# Altium project ece315.PrjPcb
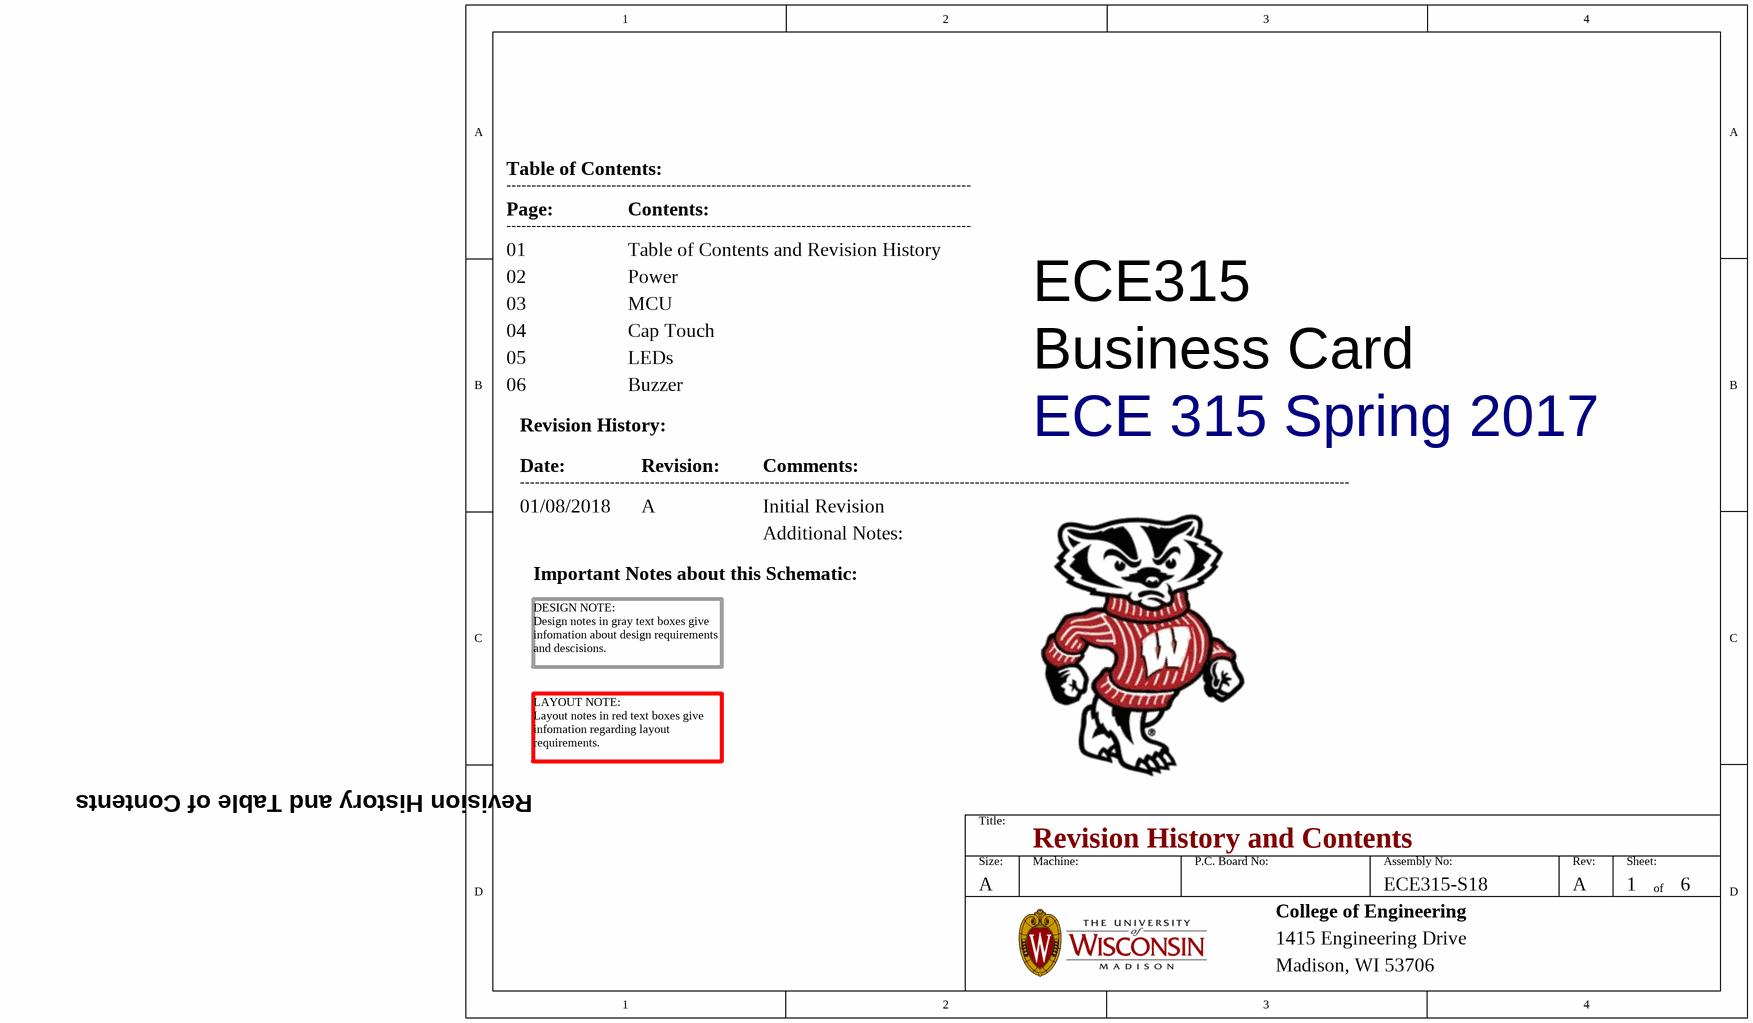
[diagram p0: 01-Revision_History_and_Contents.SchDoc]
AssemblyNumber: ECE315-S18
5 sheets, 40 parts. Net scope: global (net labels, ports and power ports of the same name join across sheets).
Board file: business_card.PcbDoc
Sheets:
  01-Revision_History_and_Contents.SchDoc
  02-Power.SchDoc
  03_MCU.SchDoc
  04_CapTouch.SchDoc
  05_LEDs.SchDoc

## Sheet 01-Revision_History_and_Contents.SchDoc: Revision History and Contents
size A; Date: 01/08/2018; ApprovedBy: JSK; CheckedBy: JSK; Author: JSK; CompanyName: University of Wisconsin; DrawnBy: JSK; Engineer: JSK; Organization: ECE 315; Address1: College of Engineering; Address2: 1415 Engineering Drive; Address3: Madison, WI 53706; Address4: ECE 315 Spring 2017; Revision: A; SheetNumber: 1; SheetTotal: 6

### Notes on the sheet
- Table of Contents:
- Page:
- ---------------------------------------------------------------------------------------------
- Contents:
- 01
- 02
- Table of Contents and Revision History
- Power
- 03
- 04
- 05
- MCU
- Cap Touch
- LEDs
- ECE315
- 06
- Revision History:
- Buzzer
- Business Card
- Date:
- ----------------------------------------------------------------------------------------------------------------------------------------------------------------------
- Revision:
- Comments:
- 01/08/2018
- A
- Initial Revision
- Additional Notes:
- Important Notes about this Schematic:
- DESIGN NOTE:
  Design notes in gray text boxes give infomation about design requirements and descisions.
- LAYOUT NOTE:
  Layout notes in red text boxes give infomation regarding layout requirements.
- Revision History and Table of Contents
- Title:
- Size:
- Machine:
- P.C. Board No:
- Assembly No:
- Rev:
- Sheet:
- of
- College of Engineering
- 1415 Engineering Drive
- Madison, WI 53706

## Sheet 02-Power.SchDoc: ECE315 Power and Programming
size A; Date: 01/08/2018; ApprovedBy: JSK; CheckedBy: JSK; Author: JSK; CompanyName: University of Wisconsin; DrawnBy: JSK; Engineer: JSK; Organization: ECE 315; Address1: College of Engineering; Address2: 1415 Engineering Drive; Address3: Madison, WI 53706; Address4: ECE 315 Spring 2018; Revision: A; SheetNumber: 2; SheetTotal: 6; AssemblyNumber: ECE315-S18; ApprovedDate: 4/25/2017
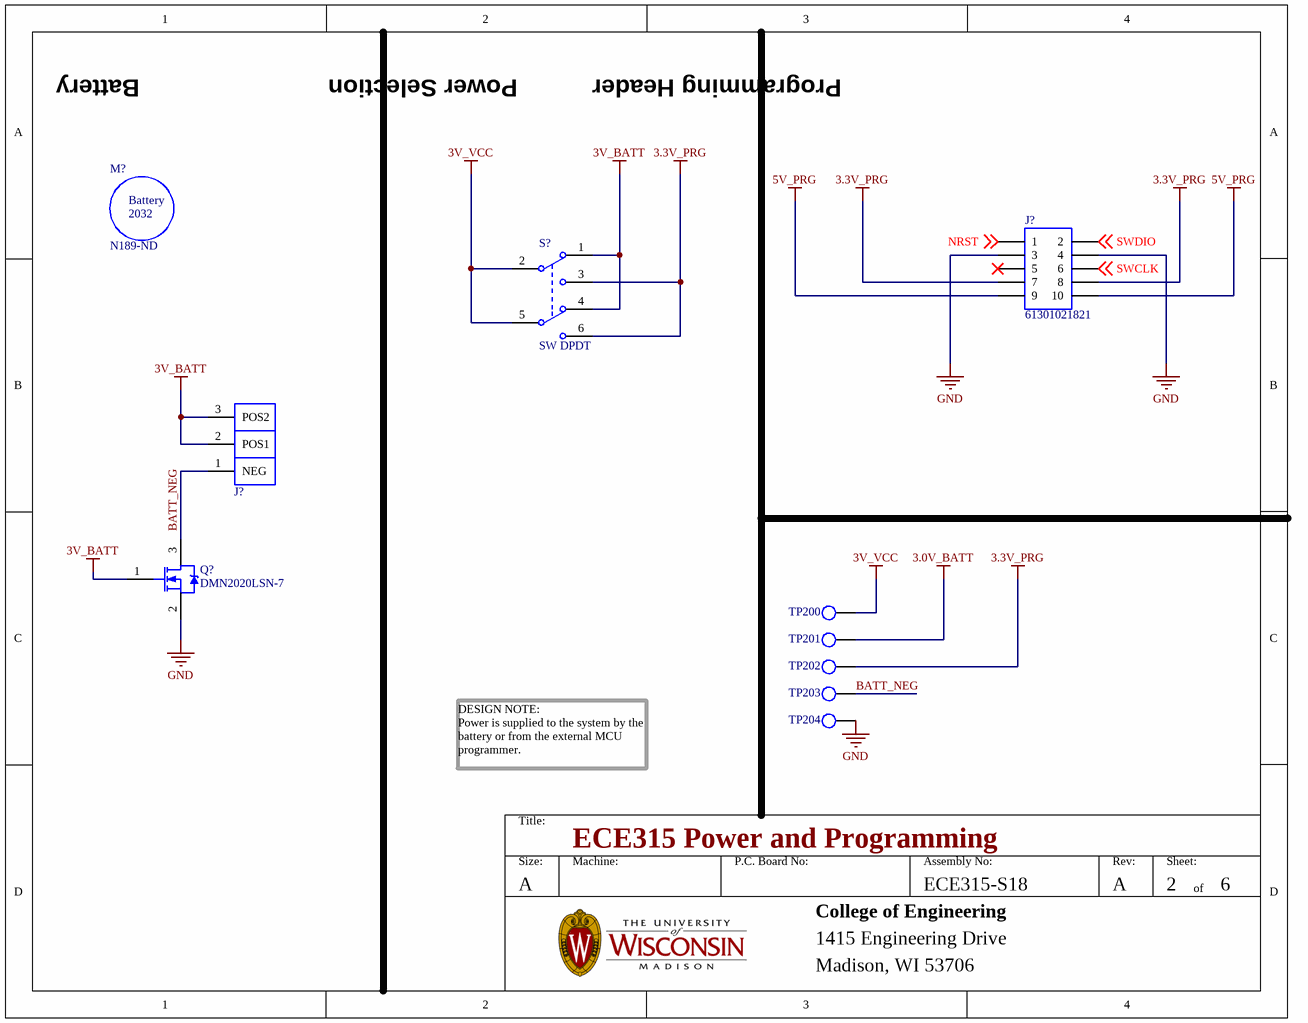
[diagram p1: 02-Power.SchDoc]

### Parts
(Parts that share a designator on the sheet are numbered #1, #2 ... from top to bottom, then left to right.)
J?#1  Manufacturer Part Number: 61301021821  [CONN_ST_PROGRAMMER]  (hidden comment: CONN_ST_PROGRAMMER)
J?#2  CONN_BAT_2032  [BATT_2032]  (value not drawn)
M?  Supplier Part Number 1: N189-ND  (hidden comment: BATTERY_2032)
Q?  Manufacturer Part Number: DMN2020LSN-7  [SOT23]  (hidden comment: IC_NMOS_DMN2020LSN)
S?  SW DPDT  [DPDT]
TP200  TP_1206  [TP-SMC-1206]  (value not drawn)
TP201  TP_1206  [TP-SMC-1206]  (value not drawn)
TP202  TP_1206  [TP-SMC-1206]  (value not drawn)
TP203  TP_1206  [TP-SMC-1206]  (value not drawn)
TP204  TP_1206  [TP-SMC-1206]  (value not drawn)

### Nets
3.0V_BATT: TP201.1
3.3V_PRG: J?#1.7 J?#1.8 S?.3(NO1) S?.6(NO2) TP202.1
3V_BATT: J?#2.2(POS1) J?#2.3(POS2) Q?.1 S?.1(NC1) S?.4(NC2)
3V_VCC: S?.2(COMMON1) S?.5(COMMON2) TP200.1
5V_PRG: J?#1.9 J?#1.10
GND: J?#1.3 J?#1.4 Q?.2 TP204.1
BATT_NEG: J?#2.1(NEG) Q?.3 TP203.1
NRST: J?#1.1 ; off-sheet NRST
SWCLK: J?#1.6 ; off-sheet SWCLK
SWDIO: J?#1.2 ; off-sheet SWDIO

Not connected (* = marked no-connect by the designer): J?#1 5*

### Notes on the sheet
- Battery
- Power Selection
- Programming Header
- DESIGN NOTE:
  Power is supplied to the system by the battery or from the external MCU programmer.
- Title:
- Size:
- A
- Machine:
- P.C. Board No:
- Assembly No:
- Rev:
- Sheet:
- of
- College of Engineering
- 1415 Engineering Drive
- Madison, WI 53706
- (in symbol BATTERY_2032) Battery; 2032

### Library data of the parts
J?#1 = CONN_ST_PROGRAMMER: CONN HEADER 2.54MM 10POS GOLD; Manufacturer: Wurth Electronics Inc.; Style: Board to Board; Number of Positions: 10; Number of Positions Loaded: All; Pitch - Mating: 0.100" (2.54mm); Contact Length - Post: 0.122" (3.10mm); Material Flammability Rating: UL94 V-0; Current Rating: 3A; Voltage Rating: 250VAC; Supplier 1: Digi-Key; RoHS: RoHS Compliant; Category: Connectors, Interconnects; Stock 1: 4086; Pricing 1: 1=0.74, 10=0.728, 50=0.672, 100=0.616, 320=0.56 (USD); Packaging: Tray; Part Status: Active; Connector Type: Header; Contact Type: Forked; Row Spacing - Mating: 0.100" (2.54mm); Mounting Type: Through Hole; Termination: Solder; Fastening Type: Push-Pull; Contact Finish - Mating: Gold; Contact Finish Thickness - Mating: -; Insulation Color: Black; Insulation Height: 0.331" (8.40mm); Operating Temperature: -40°C ~ 105°C; Contact Finish - Post: Gold; Mated Stacking Heights: -; Ingress Protection: -; Features: -; Applications: -; Insulation Material: Polybutylene Terephthalate (PBT); Contact Shape: Square; Contact Material: Copper Alloy; Contact Finish Thickness - Post: -; ComponentLink1URL: http://katalog.we-online.de/em/datasheet/6130xx21821.pdf; ComponentLink1Description: http://katalog.we-online.de/em/datasheet/6130xx21821.pdf; Supplier Part Number 1: 732-2861-ND
J?#2 = CONN_BAT_2032: HOLDER BATTERY 20MM COIN; Manufacturer: Linx; Manufacturer Part Number: BAT-HLD-001; Brand: Linx Technologies; Number of Batteries: 1 Battery; Number of Contacts: 1 Contact; Supplier 1: Digikey; Stock 1: 950; Pricing 1: 1=0.28, 25=0.2572, 100=0.233, 1000=0.2196 (USD); Product Category: Coin Cell Battery Holders; RoHS: Details; Product: Battery Holders; Battery Cell Size: 20 mm; Termination Style: SMD/SMT; Packaging: Bulk; Factory Pack Quantity: 1000; Type: 20 mm Battery Holder; ComponentLink1URL: https://datasheet.ciiva.com/4/bat-hld-001-4035.pdf; ComponentLink1Description: https://datasheet.ciiva.com/4/bat-hld-001-4035.pdf; ComponentLink2URL: https://datasheet.ciiva.com/4642/bat-hld-001-220194-4642567.pdf; ComponentLink2Description: https://datasheet.ciiva.com/4642/bat-hld-001-220194-4642567.pdf; ComponentLink3URL: https://datasheet.ciiva.com/16207/bat-hld-001-16207212.pdf; ComponentLink3Description: https://datasheet.ciiva.com/16207/bat-hld-001-16207212.pdf; Supplier Part Number 1: BAT-HLD-001-ND
M? = BATTERY_2032: Manufacturer: Energizer; Manufacturer Part Number: CR2032VP; MSDS Material Safety Datasheet: Lithium Manganese Dioxide(Coin/Button) PSDS; Battery Chemistry: Lithium; Battery Cell Size: Coin, 20.0mm; Voltage - Rated: 3V; Capacity: 240mAh; Discharge Rate: 190µA; Shipping Info: Due to possible restrictions, a change in ship method may be required.; Dynamic Catalog: CR (Coin) Series; For Use With: N533-ND / - CAP LIGHT 3-LED LITHIUM COIN; Associated Product: 952-1737-6-ND / - HOLDER BATT COIN CR2032/20MM / 952-1737-1-ND / - HOLDER BATT COIN CR2032/20MM / 952-1735-6-ND / - HOLDER BATT COIN CR2032/20MM / 952-1735-1-ND / - HOLDER BATT COIN CR2032/20MM / 952-1737-2-ND / - HOLDER BATT COIN CR2032/20MM / 952-1743-ND / - HOLDER BATT COIN CR2032/20MM / 952-1735-2-ND / - HOLDER BATT COIN CR2032/20MM / BH-20H-1TCT-ND / - HOLDER BATT COIN CELL 2032 SMD / 3082TRK-ND / - RETAINER COIN CELL 20MM SMD / 3072TRK-ND / - RETAINER COIN CELL 20MM SMD / More...; Other Names: 547-189 / 547-189-ND / N189; Supplier 1: Digikey; Stock 1: 563743; Pricing 1: 1=0.34, 10=0.31, 50=0.2758, 100=0.2414, 250=0.2207, 500=0.2069, 1000=0.1841, 2500=0.1729 (USD); Standard Package: 200; Category: Battery Products; Family: Batteries Non-Rechargeable (Primary); Series: CR2032; Size / Dimension: 0.79" Dia x 0.13" H (20.0mm x 3.2mm); Termination Style: Requires Holder; Weight: 0.1 oz (2.85g); ComponentLink1URL: https://datasheet.ciiva.com/6572/cr2032-6572607.pdf; ComponentLink1Description: https://datasheet.ciiva.com/6572/cr2032-6572607.pdf
Q? = IC_NMOS_DMN2020LSN: Manufacturer: Diodes; Rise Time: 12.49ns; Continuous Drain Current (ID): 6.9A; Gate to Source Voltage (Vgs): 12V; Turn-Off Delay Time: 35.89ns; Turn-On Delay Time: 11.67ns; Fall Time: 12.33ns; Input Capacitance: 1.149nF; Number of Elements: 1; Max Power Dissipation: 610mW; Rds On Max: 20mR; Drain to Source Resistance: 13mR; Drain to Source Voltage (Vdss): 20V; Threshold Voltage: 1V; Element Configuration: Single; Supplier 1: Digikey; Stock 1: 13099; Pricing 1: 1=0.52, 10=0.418, 100=0.2843, 500=0.2132, 1000=0.1599 (USD); Mount: Surface Mount; Case/Package: SC; Number of Pins: 3; Weight: 0.000282oz; Min Operating Temperature: -55°C; Max Operating Temperature: 150°C; Packaging: Tape and Reel; Package Quantity: 3000; Power Dissipation: 610mW; Number of Channels: 1; Length: 3.1mm; Height: 1.3mm; Width: 1.7mm; REACH SVHC: No SVHC; Lead Free: Lead Free; ComponentLink1URL: https://datasheet.ciiva.com/934/ds31946-934870.pdf; ComponentLink1Description: https://datasheet.ciiva.com/934/ds31946-934870.pdf; ComponentLink2URL: https://datasheet.ciiva.com/25625/0900766b8104e58b-25625153.pdf; ComponentLink2Description: https://datasheet.ciiva.com/25625/0900766b8104e58b-25625153.pdf; ComponentLink3URL: https://datasheet.ciiva.com/4444/ds31946-65244-4444482.pdf; ComponentLink3Description: https://datasheet.ciiva.com/4444/ds31946-65244-4444482.pdf; ComponentLink4URL: https://datasheet.ciiva.com/934/ds31946-934871.pdf; ComponentLink4Description: https://datasheet.ciiva.com/934/ds31946-934871.pdf; ComponentLink5URL: https://datasheet.ciiva.com/934/ds31946-934872.pdf; ComponentLink5Description: https://datasheet.ciiva.com/934/ds31946-934872.pdf; Supplier Part Number 1: DMN2020LSN-7DICT-ND
S? = SW DPDT: Switch; Manufacturer: ITT /  C&K Components; Manufacturer Part Number: JS202011SCQN; Actuator Color: Black; Maximum DC Voltage Rating: 6 V; Actuator Material: Nylon 4/6; Electrical Life: 15000 Cycles; Body Orientation: Straight; Maximum Contact Resistance: 70 mOhm; Actuator Style: Top Slide; Dielectric Strength: 500 VAC; Minimum Insulation Resistance: 100 MOhm; Contact Rating @ Voltage: 0.3@6VDC A; COO: US; Published: 24-Mar-1999; LatestRevisionDate: 29-May-2009; LatestRevisionNote: IPC-7351 Footprint Added.; PackageVersion: Mar-2001; PackageReference: SOT23-6; Publisher: Altium Limited; PackageDescription: 6-Pin SOT-23 Package 0.95 mm Pitch, 2.7 mm Lead Span; Code_JEITA: SC-74; Code_IPC: SOT26A-6; Supplier 1: C&K Components; Stock 1: 22661; Pricing 1: 1=0.46, 10=0.441, 25=0.4316, 50=0.3858, 100=0.3674, 250=0.3582, 500=0.3031 (USD); Part No: JS202011SCQN; RoHS: Yes; Supplier Standard Pack: 5,000; Type: Sub-Miniature; Maximum AC Voltage Rating: N/A; Family: JS; Contact Material: Copper Alloy; Seal Description: N/A; Pole Throw Configuration: DPDT; Mechanical Life: N/A; Packaging: Tape and Reel; Contact Plating: Silver; Switch Configuration: N/A; Housing Material: Nylon 4/6; Product Weight: N/A; Base Material: N/A; Mounting: Surface Mount,Gull Wing; Seal Location: N/A; Operating Temperature: -40 to 85 C; Dimension: 9 x 7.5 x 5.5 mm; HTS: 8536509050; ECCN: EAR99; ComponentLink1URL: https://datasheet.ciiva.com/23829/1707718-23829488.pdf; ComponentLink1Description: https://datasheet.ciiva.com/23829/1707718-23829488.pdf; ComponentLink2URL: https://datasheet.ciiva.com/2889/js-29aug13-2889127.pdf; ComponentLink2Description: https://datasheet.ciiva.com/2889/js-29aug13-2889127.pdf; ComponentLink3URL: https://datasheet.ciiva.com/2889/js-15sept15-2889128.pdf; ComponentLink3Description: https://datasheet.ciiva.com/2889/js-15sept15-2889128.pdf; ComponentLink4URL: https://datasheet.ciiva.com/2889/js-15sept15-2889129.pdf; ComponentLink4Description: https://datasheet.ciiva.com/2889/js-15sept15-2889129.pdf; ComponentLink5URL: https://datasheet.ciiva.com/22630/1707718-22630697.pdf; ComponentLink5Description: https://datasheet.ciiva.com/22630/1707718-22630697.pdf; ComponentLink6URL: https://datasheet.ciiva.com/8625/js-9dec14-8625470.pdf; ComponentLink6Description: https://datasheet.ciiva.com/8625/js-9dec14-8625470.pdf; Supplier Part Number 1: 401-2002-1-ND
TP200-TP204 = TP_1206: Test Point SMD 1206; Manufacturer: TE Connectivity (Tyco Electronics); Manufacturer Part Number: 1625854-1; Resistance Value: 0 Ohm; Temperature Coefficient: N/R; Supplier 1: Digi-Key; Supplier Part Number 1: A106143CT-ND; Stock 1: 31937; Pricing 1: 1=0.28, 10=0.261, 25=0.224, 50=0.1902, 100=0.1828, 250=0.1641, 500=0.1567, 1000=0.1306 (USD); Case Size: 1206; Dimension: 3.2 x 1.6 x 1.25mm; Family: RC; Mounting: Surface Mount; Operating Temperature: -55 to 125 C; Part No: 1625854-1; RoHS: Yes; Packaging: Tape and Reel; Termination Style: N/R; Terminal Pitch: N/R; Power Rating: N/R; Tolerance: N/R; ComponentLink1URL: https://datasheet.ciiva.com/6439/eng-ds-1773266-a-6439169.pdf; ComponentLink1Description: https://datasheet.ciiva.com/6439/eng-ds-1773266-a-6439169.pdf; ComponentLink2URL: https://datasheet.ciiva.com/30136/1773266-a-30136341.pdf; ComponentLink2Description: https://datasheet.ciiva.com/30136/1773266-a-30136341.pdf; ComponentLink3URL: https://datasheet.ciiva.com/6439/eng-ds-1773266-a-6439080.pdf; ComponentLink3Description: https://datasheet.ciiva.com/6439/eng-ds-1773266-a-6439080.pdf; ComponentLink4URL: https://datasheet.ciiva.com/6439/eng-ds-1773266-a-6439081.pdf; ComponentLink4Description: https://datasheet.ciiva.com/6439/eng-ds-1773266-a-6439081.pdf; ComponentLink5URL: https://datasheet.ciiva.com/6439/eng-ds-1773266-a-6439083.pdf; ComponentLink5Description: https://datasheet.ciiva.com/6439/eng-ds-1773266-a-6439083.pdf

## Sheet 03_MCU.SchDoc: ECE315 MCU
size A; Date: 4/25/2017; ApprovedBy: JSK; CheckedBy: JSK; Author: JSK; CompanyName: University of Wisconsin; DrawnBy: JSK; Engineer: JSK; Organization: ECE 315; Address1: College of Engineering; Address2: 1415 Engineering Drive; Address3: Madison, WI 53706; Address4: ECE 315 Spring 2018; Revision: A; SheetNumber: 3; SheetTotal: 6; AssemblyNumber: ECE315-S18; ApprovedDate: 01/08/2018
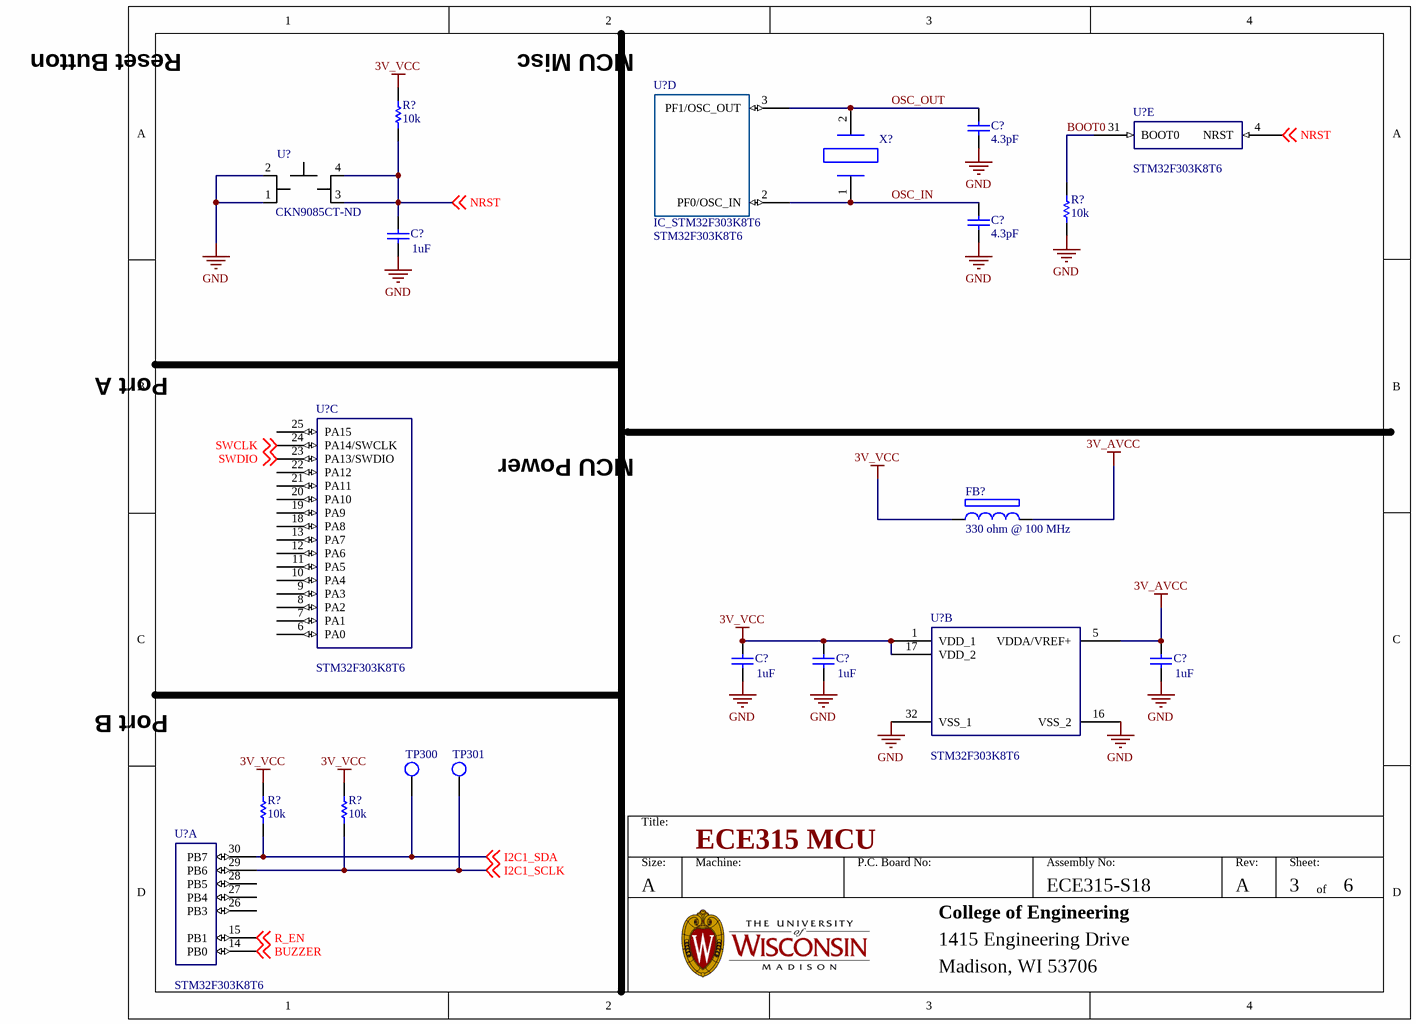
[diagram p2: 03_MCU.SchDoc]

### Parts
(Parts that share a designator on the sheet are numbered #1, #2 ... from top to bottom, then left to right.)
C?#1  Manufacturer Part Number: 4.3pF  [CAP_0805]  (hidden comment: CAP_0805_P_004.30)
C?#2  Capacity: 1uF  [CAP_0805]  (hidden comment: CAP_0805_U_001.00)
C?#3  Manufacturer Part Number: 4.3pF  [CAP_0805]  (hidden comment: CAP_0805_P_004.30)
C?#4  Capacity: 1uF  [CAP_0805]  (hidden comment: CAP_0805_U_001.00)
C?#5  Capacity: 1uF  [CAP_0805]  (hidden comment: CAP_0805_U_001.00)
C?#6  Capacity: 1uF  [CAP_0805]  (hidden comment: CAP_0805_U_001.00)
FB?  330 ohm @ 100 MHz  [FB_0805]
R?#1  10K  [RES_0805]
R?#2  10K  [RES_0805]
R?#3  10K  [RES_0805]
R?#4  10K  [RES_0805]
TP300  TP_1206  [TP-SMC-1206]  (value not drawn)
TP301  TP_1206  [TP-SMC-1206]  (value not drawn)
U?#1  IC_STM32F303K8T6  Manufacturer Part Number: STM32F303K8T6  [IC_STM32M]  (part D of 5)
U?#2  Manufacturer Part Number: STM32F303K8T6  [IC_STM32M]  (hidden comment: IC_STM32F303K8T6)  (part E of 5)
U?#3  Supplier Part Number 1: CKN9085CT-ND  [SW_6mm_6mm_SMT]  (hidden comment: SW_6mm_6mm_SMT)
U?#4  Manufacturer Part Number: STM32F303K8T6  [IC_STM32M]  (hidden comment: IC_STM32F303K8T6)  (part B of 5)
U?#5  Manufacturer Part Number: STM32F303K8T6  [IC_STM32M]  (hidden comment: IC_STM32F303K8T6)  (part C of 5)
U?#6  Manufacturer Part Number: STM32F303K8T6  [IC_STM32M]  (hidden comment: IC_STM32F303K8T6)  (part A of 5)
X?  32.7680KHZ 12.5PF  [NX3215SA-32.768K-STD-MUA-8]  (value not drawn)

### Nets
3V_AVCC: C?#6.1 FB?.2 U?#4.5(VDDA/VREF+)
3V_VCC: C?#4.1 C?#5.1 FB?.1 R?#1.2 R?#3.2 R?#4.2 U?#4.1(VDD_1) U?#4.17(VDD_2)
GND: C?#1.1 C?#2.2 C?#3.1 C?#4.2 C?#5.2 C?#6.2 R?#2.1 U?#3.1 U?#3.2 U?#4.16(VSS_2) U?#4.32(VSS_1)
BOOT0: R?#2.2 U?#2.31(BOOT0)
BUZZER: U?#6.14(PB0) ; off-sheet BUZZER
I2C1_SCLK: R?#4.1 TP301.1 U?#6.29(PB6) ; off-sheet I2C1_SCLK
I2C1_SDA: R?#3.1 TP300.1 U?#6.30(PB7) ; off-sheet I2C1_SDA
NRST: C?#2.1 R?#1.1 U?#2.4(NRST) U?#3.3 U?#3.4(VCCIO) ; off-sheet NRST
OSC_IN: C?#3.2 U?#1.2(PF0/OSC_IN) X?.1
OSC_OUT: C?#1.2 U?#1.3(PF1/OSC_OUT) X?.2
R_EN: U?#6.15(PB1) ; off-sheet R_EN
SWCLK: U?#5.24(PA14/SWCLK) ; off-sheet SWCLK
SWDIO: U?#5.23(PA13/SWDIO) ; off-sheet SWDIO

Not connected (* = marked no-connect by the designer): U?#5 6(PA0) 7(PA1) 8(PA2) 9(PA3) 10(PA4) 11(PA5) 12(PA6) 13(PA7) 18(PA8) 19(PA9) 20(PA10) 21(PA11) 22(PA12) 25(PA15); U?#6 26(PB3) 27(PB4) 28(PB5)

### Notes on the sheet
- Reset Button
- (near U?#1) MCU Misc
- Port A
- MCU Power
- Port B
- Title:
- Size:
- A
- Machine:
- P.C. Board No:
- Assembly No:
- Rev:
- Sheet:
- of
- College of Engineering
- 1415 Engineering Drive
- Madison, WI 53706

### Library data of the parts
C?#1 C?#3 = CAP_0805_P_004.30: CAP CER 4.3PF 100V NP0 0805; Manufacturer: AVX Corporation; Tolerance: ±0.25pF; Temperature Coefficient: C0G, NP0; Notification: Current market demand for these product types have resulted in fluctuating and extending lead times. Lead times may differ.; Supplier 1: Digi-Key; RoHS: RoHS Compliant; Category: Capacitors; Stock 1: 21910; Pricing 1: 1=0.24, 10=0.167, 100=0.0946, 500=0.0668, 1000=0.05844 (USD); Packaging: Cut Tape (CT); Part Status: Active; Voltage - Rated: 100V; Operating Temperature: -55°C ~ 125°C; Features: -; Ratings: -; Applications: General Purpose; Failure Rate: -; Mounting Type: Surface Mount, MLCC; Package / Case: 0805 (2012 Metric); Size / Dimension: 0.079" L x 0.049" W (2.01mm x 1.25mm); Height - Seated (Max): -; Thickness (Max): 0.037" (0.94mm); Lead Spacing: -; Lead Style: -; ComponentLink1URL: http://datasheets.avx.com/C0GNP0-Dielectric.pdf; ComponentLink1Description: http://datasheets.avx.com/C0GNP0-Dielectric.pdf; Supplier Part Number 1: 478-10404-1-ND
C?#2 C?#4-C?#6 = CAP_0805_U_001.00: CAP CER 1UF 16V 10% X7R 0805; Manufacturer: Yageo; Manufacturer Part Number: CC0805KKX7R7BB105; Notification: Current market demand for these product types have resulted in fluctuating and extending lead times. Lead times may differ.; Supplier 1: Digi-Key; RoHS: RoHS Compliant; Category: Capacitors; Stock 1: 1057802; Pricing 1: 1=0.11, 10=0.079, 100=0.0352, 500=0.02516, 1000=0.01977 (USD); Packaging: Cut Tape (CT); Part Status: Active; Tolerance: ±10%; Voltage - Rated: 16V; Temperature Coefficient: X7R; Operating Temperature: -55°C ~ 125°C; Features: -; Ratings: -; Applications: General Purpose; Failure Rate: -; Mounting Type: Surface Mount, MLCC; Package / Case: 0805 (2012 Metric); Size / Dimension: 0.079" L x 0.049" W (2.00mm x 1.25mm); Height - Seated (Max): -; Thickness (Max): 0.049" (1.25mm); Lead Spacing: -; Lead Style: -; ComponentLink1URL: http://www.yageo.com/documents/recent/UPY-GPHC_X7R_6.3V-to-50V_18.pdf; ComponentLink1Description: http://www.yageo.com/documents/recent/UPY-GPHC_X7R_6.3V-to-50V_18.pdf; Supplier Part Number 1: 311-1365-1-ND
FB? = FB 330 ohm @ 100 MHz: Manufacturer: TDK Corporation; Manufacturer Part Number: MPZ2012S331AT000; Current Rating: 2.5A; DC Resistance (DCR): 50 mOhm Max; Filter Type: Differential Mode - Single; Supplier 1: Digi-Key; RoHS: RoHS Compliant; Category: Filters; Stock 1: 154063; Pricing 1: 1=0.12, 10=0.101, 100=0.0574, 250=0.04528, 500=0.03824, 1000=0.03221 (USD); Packaging: Cut Tape (CT); Impedance @ Frequency: 330 Ohm @ 100MHz; Package / Case: 0805 (2012 Metric); Mounting Type: Surface Mount; Height (Max): 0.041" (1.05mm); Size / Dimension: 0.079" L x 0.049" W (2.00mm x 1.25mm); ComponentLink1URL: http://product.tdk.com/en/catalog/datasheets/beads_commercial_power_mpz_en.pdf; ComponentLink1Description: http://product.tdk.com/en/catalog/datasheets/beads_commercial_power_mpz_en.pdf; Supplier Part Number 1: 445-1569-1-ND
R?#1-R?#4 = RES_0805_K_010.00: RES SMD 10K OHM 1% 1/8W 0805; Manufacturer: Yageo; Manufacturer Part Number: RT0805FRE0710KL; Power (Watts): 0.125W, 1/8W; Temperature Coefficient: ±50ppm/°C; Supplier 1: Digi-Key; RoHS: RoHS Compliant; Category: Resistors; Stock 1: 74175; Pricing 1: 1=0.1, 10=0.075, 100=0.0287, 1000=0.01261, 2500=0.01089 (USD); Packaging: Cut Tape (CT); Part Status: Active; Tolerance: ±1%; Composition: Thin Film; Features: Moisture Resistant; Operating Temperature: -55°C ~ 155°C; Package / Case: 0805 (2012 Metric); Supplier Device Package: 0805; Size / Dimension: 0.079" L x 0.049" W (2.00mm x 1.25mm); Height - Seated (Max): 0.024" (0.60mm); Failure Rate: -; ComponentLink1URL: http://www.yageo.com/documents/recent/PYu-RT_1-to-0.01_RoHS_L_9.pdf; ComponentLink1Description: http://www.yageo.com/documents/recent/PYu-RT_1-to-0.01_RoHS_L_9.pdf; Supplier Part Number 1: YAG1239CT-ND; Resistance: 10k
TP300 TP301 = TP_1206: as TP200 on sheet 02-Power; Supplier 1: Digi-Key; Stock 1: 31937; Pricing 1: 1=0.28, 10=0.261, 25=0.224, 50=0.1902, 100=0.1828, 250=0.1641, 500=0.1567, 1000=0.1306 (USD); Case Size: 1206; Dimension: 3.2 x 1.6 x 1.25mm; Family: RC; Mounting: Surface Mount; Operating Temperature: -55 to 125 C; Part No: 1625854-1; RoHS: Yes; Packaging: Tape and Reel; Termination Style: N/R; Terminal Pitch: N/R; Power Rating: N/R; Tolerance: N/R; ComponentLink1URL: https://datasheet.ciiva.com/6439/eng-ds-1773266-a-6439169.pdf; ComponentLink1Description: https://datasheet.ciiva.com/6439/eng-ds-1773266-a-6439169.pdf; ComponentLink2URL: https://datasheet.ciiva.com/30136/1773266-a-30136341.pdf; ComponentLink2Description: https://datasheet.ciiva.com/30136/1773266-a-30136341.pdf; ComponentLink3URL: https://datasheet.ciiva.com/6439/eng-ds-1773266-a-6439080.pdf; ComponentLink3Description: https://datasheet.ciiva.com/6439/eng-ds-1773266-a-6439080.pdf; ComponentLink4URL: https://datasheet.ciiva.com/6439/eng-ds-1773266-a-6439081.pdf; ComponentLink4Description: https://datasheet.ciiva.com/6439/eng-ds-1773266-a-6439081.pdf; ComponentLink5URL: https://datasheet.ciiva.com/6439/eng-ds-1773266-a-6439083.pdf; ComponentLink5Description: https://datasheet.ciiva.com/6439/eng-ds-1773266-a-6439083.pdf; Supplier Part Number 1: A106143CT-ND
U?#1 U?#2 U?#4-U?#6 = IC_STM32F303K8T6: Manufacturer: STMicroelectronics; Core Processor: ARM® Cortex®-M4; Core Size: 32-Bit; Speed: 72MHz; Connectivity: CAN, I²C, IrDA, LIN, SPI, UART/USART; Peripherals: DMA, I²S, POR, PWM, WDT; Program Memory Size: 64KB (64K x 8); Program Memory Type: FLASH; RAM Size: 12K x 8; Voltage - Supply (Vcc/Vdd): 2 V ~ 3.6 V; Data Converters: A/D 9x12b, D/A 3x12b; Oscillator Type: Internal; Supplier 1: Digi-Key; RoHS: RoHS Compliant; Category: Integrated Circuits (ICs); Stock 1: 1323; Pricing 1: 1=4.28, 10=3.846, 100=3.1512, 500=2.68256, 1000=2.2624 (USD); Packaging: Tray; Part Status: Active; EEPROM Size: -; Operating Temperature: -40°C ~ 85°C (TA); Package / Case: 32-LQFP; Supplier Device Package: 32-LQFP (7x7); ComponentLink1URL: http://www.st.com/content/ccc/resource/technical/document/datasheet/group3/38/c6/ca/d1/f7/d5/4e/30/DM00092070/files/DM00092070.pdf/jcr:content/translations/en.DM00092070.pdf; ComponentLink1Description: http://www.st.com/content/ccc/resource/technical/document/datasheet/group3/38/c6/ca/d1/f7/d5/4e/30/DM00092070/files/DM00092070.pdf/jcr:content/translations/en.DM00092070.pdf; Supplier Part Number 1: 497-15828-ND
U?#3 = SW_6mm_6mm_SMT: SWITCH TACTILE SPST-NO 0.05A 12V; Manufacturer: C&K; Manufacturer Part Number: PTS645SH50SMTR92 LFS; Switch Function: Off-Mom; Contact Rating @ Voltage: 0.05A @ 12VDC; Actuator Type: Standard; Actuator Height off PCB, Vertical: 5.00mm; Actuator Orientation: Top Actuated; Outline: 6.00mm x 6.00mm; Illumination: Non-Illuminated; Operating Force: 200gf; Actuator Material: Polyamide (PA66), Nylon 6/6; Mechanical Life: 100,000 Cycles; Supplier 1: Digi-Key; RoHS: RoHS Compliant; Category: Switches; Stock 1: 73248; Pricing 1: 1=0.22, 10=0.215, 25=0.2076, 50=0.2002, 100=0.1891, 250=0.17796, 500=0.17054 (USD); Packaging: Cut Tape (CT); Part Status: Active; Circuit: SPST-NO; Mounting Type: Surface Mount; Actuator Length, Right Angle: -; Termination Style: Gull Wing; Illumination Type, Color: -; Illumination Voltage (Nominal): -; Ingress Protection: -; Features: -; Switch Travel: -; Operating Temperature: -20°C ~ 60°C; ComponentLink1URL: http://www.ckswitches.com/media/1471/pts645.pdf; ComponentLink1Description: http://www.ckswitches.com/media/1471/pts645.pdf
X? = CRYSTAL_NX3215SA-32.768K: CRYSTAL 32.768KHZ 12.5PF SMD; Manufacturer: Nihon Dempa Kogyo (NDK); Catalog Drawings: NX3215SA Series Top / NX3215SA Series Side / NX3215SA Series Bottom / NX3215SA Series Circuit; Featured Product: NX3215SA Series 32.768KHz SMD Crystals; Frequency Tolerance: ±20ppm; ESR (Equivalent Series Resistance): 70 kOhm; Operating Mode: Fundamental; Dynamic Catalog: NX3215SA Series; Other Names: 644-1156-6; Supplier 1: Digikey; Stock 1: 45314; Pricing 1: 1=0.94, 10=0.835, 50=0.7804, 100=0.6897, 500=0.6534, 1000=0.5445 (USD); Standard Package: 1; Category: Crystals and Oscillators; Family: Crystals; Series: NX3215SA; Type: kHz Crystal (Tuning Fork); Frequency: 32.768kHz; Load Capacitance: 12.5pF; Operating Temperature: -40°C ~ 85°C; Mounting Type: Surface Mount; Package / Case: 2-SMD; Size / Dimension: 0.126" L x 0.059" W (3.20mm x 1.50mm); Height: 0.035" (0.90mm); Packaging: Digi-Reel®; ComponentLink1URL: https://datasheet.ciiva.com/857/c-nx3215sa-std-mua-9-e-857050.pdf; ComponentLink1Description: https://datasheet.ciiva.com/857/c-nx3215sa-std-mua-9-e-857050.pdf; ComponentLink2URL: https://datasheet.ciiva.com/857/c-nx3215sa-std-mua-9-e-857051.pdf; ComponentLink2Description: https://datasheet.ciiva.com/857/c-nx3215sa-std-mua-9-e-857051.pdf; ComponentLink3URL: https://datasheet.ciiva.com/857/c-nx3215sa-std-mua-9-e-857052.pdf; ComponentLink3Description: https://datasheet.ciiva.com/857/c-nx3215sa-std-mua-9-e-857052.pdf; Supplier Part Number 1: 644-1156-1-ND; Manufacturer Part Number: NX3215SA-32.768K-STD-MUA-8

## Sheet 04_CapTouch.SchDoc: ECE315 Capacitive Touch
size A; Date: 01/08/2018; ApprovedBy: JSK; CheckedBy: JSK; Author: JSK; CompanyName: University of Wisconsin; DrawnBy: JSK; Engineer: JSK; Organization: ECE 315; Address1: College of Engineering; Address2: 1415 Engineering Drive; Address3: Madison, WI 53706; Address4: ECE 315 Spring 2018; Revision: A; SheetNumber: 4; SheetTotal: 6; AssemblyNumber: ECE315-S18; ApprovedDate: 4/25/2017
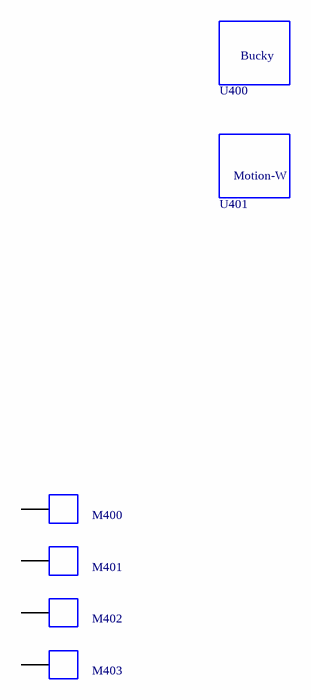
[diagram p3: 04_CapTouch.SchDoc]

### Parts
M400  Mech_TouchPad  [TouchPad]  (value not drawn)  (no BOM)
M401  Mech_TouchPad  [TouchPad]  (value not drawn)  (no BOM)
M402  Mech_TouchPad  [TouchPad]  (value not drawn)  (no BOM)
M403  Mech_TouchPad  [TouchPad]  (value not drawn)  (no BOM)
U400  Bucky  [BuckyBadger]  (value not drawn)  (no BOM)
U401  Motion_W  [Motion_W]  (value not drawn)  (no BOM)

### Nets

Not connected (* = marked no-connect by the designer): M400 1; M401 1; M402 1; M403 1

### Notes on the sheet
- Title:
- Size:
- A
- Machine:
- P.C. Board No:
- Assembly No:
- Rev:
- Sheet:
- of
- College of Engineering
- 1415 Engineering Drive
- Madison, WI 53706
- (in symbol Motion_W) Motion-W

### Library data of the parts
M400-M403 = Mech_TouchPad: Capacative Touch Sensor Pad
U400 = Bucky: Bucky Badger Image; Manufacturer Part Number: UW Bucky
U401 = Motion_W: Motion W Image; Manufacturer Part Number: UW Bucky

## Sheet 05_LEDs.SchDoc: ECE315 LEDs
size A; Date: 01/08/2018; ApprovedBy: JSK; CheckedBy: JSK; Author: JSK; CompanyName: University of Wisconsin; DrawnBy: JSK; Engineer: JSK; Organization: ECE 315; Address1: College of Engineering; Address2: 1415 Engineering Drive; Address3: Madison, WI 53706; Address4: ECE 315 Spring 2018; Revision: A; SheetNumber: 5; SheetTotal: 6; AssemblyNumber: ECE315-S18; ApprovedDate: ECE315-S18
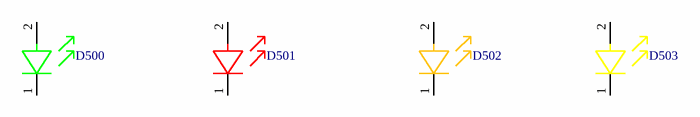
[diagram p4: 05_LEDs.SchDoc]

### Parts
D500  LED_GREEN_0805.1  [LED_GRN_0805]  (value not drawn)
D501  LED_RED_0805.1  [LED_RED_0805]  (value not drawn)
D502  LED_ORANGE.0805.1  [LED_ORG_0805]  (value not drawn)
D503  LED_YELLOW_0805.1  [LED_YEL_0805]  (value not drawn)

### Nets

Not connected (* = marked no-connect by the designer): D500 1(Cathode) 2(Anode); D501 1(Cathode) 2(Anode); D502 1(Cathode) 2(Anode); D503 1(Cathode) 2(Anode)

### Notes on the sheet
- Title:
- Size:
- A
- Machine:
- P.C. Board No:
- Assembly No:
- Rev:
- Sheet:
- of
- College of Engineering
- 1415 Engineering Drive
- Madison, WI 53706

### Library data of the parts
D500 = LED_GREEN_0805.1: LED GREEN CLEAR THIN 0805 SMD; Manufacturer: Vishay / Lite-On; Manufacturer Part Number: LTST-C171KGKT; Chip Material: AlGaInP; DELETED: Compliant; Emitting Color: Yellow Green; Forward Voltage: 2.4 V; Forward Current: 30 mA; Dominant Wave Length: 571 nm; Lum Intensity: 35mcd; High Brightness: Yes; Number of  Elements: 1; Main Category: Chip LED; Power Dissipation: 75 W; Peak Wavelength: 574 nm; Shape Type: Rectangular; Type: Uni-Color; Reverse Voltage: 5 V; Viewing Angle: 130 deg; Test Current (It): 20 mA; Rad Hardened: No; Product Depth (mm): 1.25 mm; Product Height (mm): 0.8 mm; Product Length (mm): 2 mm; Supplier 1: Digi-Key; Stock 1: 322411; Pricing 1: 1=0.31, 10=0.225, 25=0.1656, 100=0.1183, 250=0.0804, 500=0.071, 1000=0.0556 (USD); Mounting: Surface Mount; Operating Temp Range: -55C to 85C; Lens Dimensions: 1.4x1.25x0.5 mm; Luminous Intensity: 35mcd; Package Type: Chip Led; Packaging: Tape and Reel; Pin Count: 2; Operating Temperature Classification: Industrial; ComponentLink1URL: https://datasheet.ciiva.com/15118/getdatasheetpartid-214542-15118099.pdf; ComponentLink1Description: https://datasheet.ciiva.com/15118/getdatasheetpartid-214542-15118099.pdf; ComponentLink2URL: https://datasheet.ciiva.com/16200/lite-on20ltst-c171kgkt-16200100.pdf; ComponentLink2Description: https://datasheet.ciiva.com/16200/lite-on20ltst-c171kgkt-16200100.pdf; ComponentLink3URL: https://datasheet.ciiva.com/2110/s-110-ltst-c171kgkt-2110072.pdf; ComponentLink3Description: https://datasheet.ciiva.com/2110/s-110-ltst-c171kgkt-2110072.pdf; ComponentLink4URL: https://datasheet.ciiva.com/2110/s-110-ltst-c171kgkt-2110073.pdf; ComponentLink4Description: https://datasheet.ciiva.com/2110/s-110-ltst-c171kgkt-2110073.pdf; ComponentLink5URL: https://datasheet.ciiva.com/11774/0900766b80dc0298-11774377.pdf; ComponentLink5Description: https://datasheet.ciiva.com/11774/0900766b80dc0298-11774377.pdf; ComponentLink6URL: https://datasheet.ciiva.com/2110/s-110-ltst-c171kgkt-2110074.pdf; ComponentLink6Description: https://datasheet.ciiva.com/2110/s-110-ltst-c171kgkt-2110074.pdf; ComponentLink7URL: https://datasheet.ciiva.com/12400/lite-on-ltst-c171kgkt-187692-12400799.pdf; ComponentLink7Description: https://datasheet.ciiva.com/12400/lite-on-ltst-c171kgkt-187692-12400799.pdf; Supplier Part Number 1: 160-1426-1-ND
D501 = LED_RED_0805.1: LED SUPER RED CLR THIN 0805 SMD; Manufacturer: Vishay / Lite-On; Manufacturer Part Number: LTST-C171KRKT; Chip Material: AlGaInP; DELETED: Compliant; Dominant Wave Length: 631 nm; Forward Current: 30 mA; Forward Voltage: 2.4 V; High Brightness: Yes; Lum Intensity: 54mcd; Main Category: Chip LED; Number of  Elements: 1; Peak Wavelength: 639 nm; Power Dissipation: 75 W; Product Depth (mm): 1.25 mm; Product Height (mm): 0.8 mm; Product Length (mm): 2 mm; Rad Hardened: No; Reverse Voltage: 5 V; Shape Type: Rectangular; Test Current (It): 20 mA; Type: Uni-Color; Viewing Angle: 130 deg; Supplier 1: Digikey; Stock 1: 97347; Pricing 1: 1=0.31, 10=0.225, 25=0.1656, 100=0.1183, 250=0.0804, 500=0.071, 1000=0.0556 (USD); Emitting Color: Red; Lens Dimensions: 1.4x1.25x0.5 mm; Luminous Intensity: 54mcd; Mounting: Surface Mount; Operating Temp Range: -55C to 85C; Operating Temperature Classification: Industrial; Package Type: Chip Led; Packaging: Tape and Reel; Pin Count: 2; ComponentLink1URL: https://datasheet.ciiva.com/2110/s-110-ltst-c171krkt-2110066.pdf; ComponentLink1Description: https://datasheet.ciiva.com/2110/s-110-ltst-c171krkt-2110066.pdf; ComponentLink2URL: https://datasheet.ciiva.com/2110/s-110-ltst-c171krkt-2110067.pdf; ComponentLink2Description: https://datasheet.ciiva.com/2110/s-110-ltst-c171krkt-2110067.pdf; ComponentLink3URL: https://datasheet.ciiva.com/2110/s-110-ltst-c171krkt-2110068.pdf; ComponentLink3Description: https://datasheet.ciiva.com/2110/s-110-ltst-c171krkt-2110068.pdf; ComponentLink4URL: https://datasheet.ciiva.com/12403/lite-on-ltst-c171krkt-187201-12403781.pdf; ComponentLink4Description: https://datasheet.ciiva.com/12403/lite-on-ltst-c171krkt-187201-12403781.pdf; ComponentLink5URL: https://datasheet.ciiva.com/11775/0900766b80dc0299-11775643.pdf; ComponentLink5Description: https://datasheet.ciiva.com/11775/0900766b80dc0299-11775643.pdf; ComponentLink6URL: https://datasheet.ciiva.com/16444/lite-on20ltst-c171krkt-16444779.pdf; ComponentLink6Description: https://datasheet.ciiva.com/16444/lite-on20ltst-c171krkt-16444779.pdf; Supplier Part Number 1: 160-1427-1-ND
D502 = LED_ORANGE.0805.1: LED ORANGE DIFFUSED 0805 SMD; Manufacturer: Rohm; Manufacturer Part Number: SML-210DTT86; Intensity: 6.3 mcd; Lens Type: Clear; Forward (Drive) Current: 25 mA; Forward Voltage: 2 V; Viewing Angle: 130 °; Supplier 1: Digikey; Stock 1: 28453; Pricing 1: 1=0.39, 10=0.277, 25=0.2404, 100=0.1848, 250=0.1502, 500=0.1109, 1000=0.0924 (USD); Color: Orange; Dimension: 2 x 1.25 x 0.8 mm; ComponentLink1URL: https://datasheet.ciiva.com/2110/sml-21-2110727.pdf; ComponentLink1Description: https://datasheet.ciiva.com/2110/sml-21-2110727.pdf; ComponentLink2URL: https://datasheet.ciiva.com/2110/sml-21-2110728.pdf; ComponentLink2Description: https://datasheet.ciiva.com/2110/sml-21-2110728.pdf; ComponentLink3URL: https://datasheet.ciiva.com/2110/sml-21-2110729.pdf; ComponentLink3Description: https://datasheet.ciiva.com/2110/sml-21-2110729.pdf; ComponentLink4URL: https://datasheet.ciiva.com/11773/0900766b80df3a40-11773931.pdf; ComponentLink4Description: https://datasheet.ciiva.com/11773/0900766b80df3a40-11773931.pdf; ComponentLink5URL: https://datasheet.ciiva.com/16488/sml-210ltt86-16488028.pdf; ComponentLink5Description: https://datasheet.ciiva.com/16488/sml-210ltt86-16488028.pdf; Supplier Part Number 1: 511-1284-1-ND
D503 = LED_YELLOW_0805.1: LED YELLOW CLEAR THIN 0805 SMD; Manufacturer: Vishay / Lite-On; Manufacturer Part Number: LTST-C171KSKT; Chip Material: AlGaInP; DELETED: Compliant; Emitting Color: Amber; Forward Voltage: 2.4 V; Forward Current: 30 mA; Dominant Wave Length: 587 nm; Lum Intensity: 50mcd; High Brightness: Yes; Number of  Elements: 1; Main Category: Chip LED; Power Dissipation: 75 W; Peak Wavelength: 588 nm; Shape Type: Rectangular; Type: Uni-Color; Reverse Voltage: 5 V; Viewing Angle: 130 deg; Test Current (It): 20 mA; Rad Hardened: No; Product Depth (mm): 1.25 mm; Product Height (mm): 0.8 mm; Product Length (mm): 2 mm; Supplier 1: Digikey; Stock 1: 18113; Pricing 1: 1=0.33, 10=0.239, 25=0.1764, 100=0.126, 250=0.0856, 500=0.0756, 1000=0.0592 (USD); Mounting: Surface Mount; Operating Temp Range: -55C to 85C; Lens Dimensions: 1.4x1.25x0.5 mm; Luminous Intensity: 50mcd; Package Type: Chip Led; Packaging: Tape and Reel; Pin Count: 2; Operating Temperature Classification: Industrial; ComponentLink1URL: https://datasheet.ciiva.com/15118/getdatasheetpartid-233685-15118145.pdf; ComponentLink1Description: https://datasheet.ciiva.com/15118/getdatasheetpartid-233685-15118145.pdf; ComponentLink2URL: https://datasheet.ciiva.com/2110/s-110-ltst-c171kskt-2110147.pdf; ComponentLink2Description: https://datasheet.ciiva.com/2110/s-110-ltst-c171kskt-2110147.pdf; ComponentLink3URL: https://datasheet.ciiva.com/2110/s-110-ltst-c171kskt-2110148.pdf; ComponentLink3Description: https://datasheet.ciiva.com/2110/s-110-ltst-c171kskt-2110148.pdf; ComponentLink4URL: https://datasheet.ciiva.com/19466/2075639-19466196.pdf; ComponentLink4Description: https://datasheet.ciiva.com/19466/2075639-19466196.pdf; ComponentLink5URL: https://datasheet.ciiva.com/2110/s-110-ltst-c171kskt-2110149.pdf; ComponentLink5Description: https://datasheet.ciiva.com/2110/s-110-ltst-c171kskt-2110149.pdf; ComponentLink6URL: https://datasheet.ciiva.com/16200/lite-on20ltst-c171kskt-16200102.pdf; ComponentLink6Description: https://datasheet.ciiva.com/16200/lite-on20ltst-c171kskt-16200102.pdf; ComponentLink7URL: https://datasheet.ciiva.com/12403/lite-on-ltst-c171kskt-190118-12403721.pdf; ComponentLink7Description: https://datasheet.ciiva.com/12403/lite-on-ltst-c171kskt-190118-12403721.pdf; ComponentLink8URL: https://datasheet.ciiva.com/11774/0900766b80dc029a-11774587.pdf; ComponentLink8Description: https://datasheet.ciiva.com/11774/0900766b80dc029a-11774587.pdf; Supplier Part Number 1: 160-1428-1-ND

## Nets that join several sheets
3V_VCC: 02-Power (S?.2 S?.5 TP200.1), 03_MCU (8 pins)
GND: 02-Power (J?#1.3 J?#1.4 Q?.2 TP204.1), 03_MCU (11 pins)
NRST: 02-Power (J?#1.1), 03_MCU (5 pins)
SWCLK: 02-Power (J?#1.6), 03_MCU (U?#5.24)
SWDIO: 02-Power (J?#1.2), 03_MCU (U?#5.23)